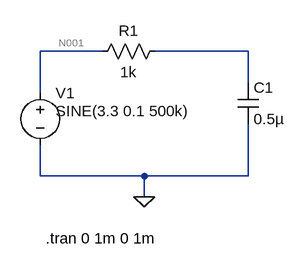
[diagram p0: schematic Noise Simulation.asc]
Noise Simulation.asc, the LTspice schematic file:
Version 4
SHEET 1 880 680
WIRE 16 64 -80 64
WIRE 240 64 96 64
WIRE 240 112 240 64
WIRE -80 128 -80 64
WIRE -80 256 -80 208
WIRE 80 256 -80 256
WIRE 240 256 240 176
WIRE 240 256 80 256
WIRE 80 288 80 256
FLAG 80 288 0
SYMBOL voltage -80 112 R0
WINDOW 3 24 44 Left 2
WINDOW 123 0 0 Left 0
WINDOW 39 0 0 Left 0
SYMATTR Value SINE(3.3 0.1 500k)
SYMATTR InstName V1
SYMBOL res 112 48 R90
WINDOW 0 0 56 VBottom 2
WINDOW 3 32 56 VTop 2
SYMATTR InstName R1
SYMATTR Value 1k
SYMBOL cap 224 112 R0
SYMATTR InstName C1
SYMATTR Value 0.5µ
TEXT -72 352 Left 2 !.tran 0 1m 0 1m

The netlist it stands for:
* Noise Simulation.asc
V1 N001 0 SINE(3.3 0.1 500k)
R1 N002 N001 1k
C1 N002 0 0.5µ
.tran 0 1m 0 1m
.backanno
.end

* Results of the author's LTspice run, read from the files saved beside the schematic
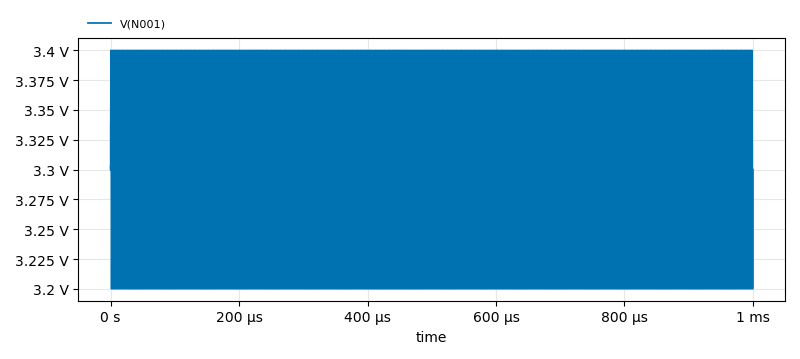
[diagram p1: Transient Analysis of Noise Simulation.asc, plotted from the saved traces]
* Transient Analysis, 1 run:
*   V(N001): min 3.2 V, max 3.4 V, average 3.3 V, rms 3.301 V, last 3.3 V